# EAGLE design pot-boardDesp2 (EAGLE 6.6.0)
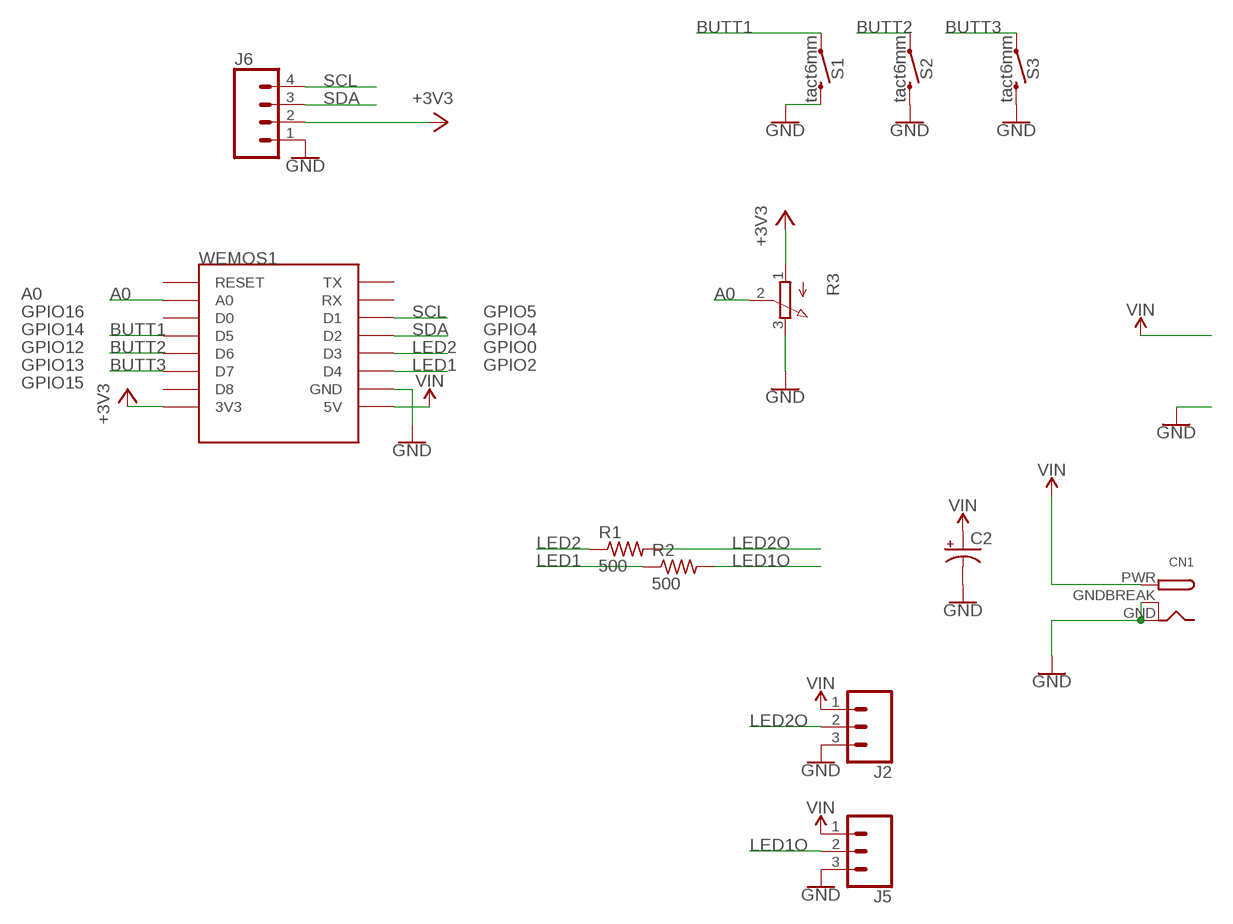
[diagram p0: schematic, sheet 1]

## Parts
C2  CPOL-USE3.5-8  [E3,5-8]
CN1  DCBARRELPTH  [DCJACK_2MM_PTH]
J2  CONN_03  [1X03]
J5  CONN_03  [1X03]
J6  CONN_04  [1X04]
R1  500  R-US_R0805  [R0805]
R2  500  R-US_R0805  [R0805]
R3  3RP/1610N  [3RP/1610N]
S1  tact6mm  MOMENTARY-SWITCH-SPST-PTH-6.0MM  [TACTILE_SWITCH_PTH_6.0MM]
S2  tact6mm  MOMENTARY-SWITCH-SPST-PTH-6.0MM  [TACTILE_SWITCH_PTH_6.0MM]
S3  tact6mm  MOMENTARY-SWITCH-SPST-PTH-6.0MM  [TACTILE_SWITCH_PTH_6.0MM]
WEMOS1  WEMOS-D1-MINI  [WEMOS-D1-MINI]

## Nets
+3V3: J6.2 R3.1(A) WEMOS1.3V3
A0: R3.2(S) WEMOS1.A0
BUTT1: S1.1 WEMOS1.D5
BUTT2: S2.1 WEMOS1.D6
BUTT3: S3.1 WEMOS1.D7
GND: C2.- CN1.GND CN1.GNDBREAK J2.3 J5.3 J6.1 R3.3(E) S1.3 S2.3 S3.3 WEMOS1.GND
LED1: R2.1 WEMOS1.D4
LED1O: J5.2 R2.2
LED2: R1.1 WEMOS1.D3
LED2O: J2.2 R1.2
SCL: J6.4 WEMOS1.D1
SDA: J6.3 WEMOS1.D2
VIN: C2.+ CN1.PWR J2.1 J5.1 WEMOS1.5V
Unconnected: WEMOS1.D0 WEMOS1.D8 WEMOS1.RESET WEMOS1.RX WEMOS1.TX

## Notes on the sheet
- A0
- GPIO16 | GPIO5
- GPIO14 | GPIO4
- GPIO12 | GPIO0
- GPIO13 | GPIO2
- GPIO15

## Library data of the parts
C2 = adafruit:CPOL-US: POLARIZED CAPACITOR, American symbol
CN1 = adafruit:DCBARREL: 2.0mm DC Barrel Jack DCJACK_2MM_PTH - Through Hole Jack (4UConnector: 05537)
J2 J5 = SparkFun-Connectors:CONN_03: Multi connection point. Often used as Generic Header-pin footprint for 0.1 inch spaced/style header connections On any of the 0.1 inch spaced packages, you can populate with these: Break Away Headers - Straight <https://www.sparkfun.com/products/116> (PRT-00116) Break Away Male Headers - Right Angle <https://www.sparkfun.com/products/553> (PRT-00553) Female Headers <https://www.sparkfun.com/products/115> (PRT-00115) Break Away Headers - Machine Pin <https://www.sparkfun.com/products/117> (PRT-00117) Break Away Female Headers - Swiss Machine Pin <https://www.sparkfun.com/products/743> (PRT-00743) Stackable Header - 3 Pin (Female, 0.1") <https://www.sparkfun.com/products/13875> (PRT-13875) For SCREWTERMINALS and SPRING TERMINALS visit here: Screw Terimnals on SparkFun.com <https://www.sparkfun.com/search/results?term=Screw+Terminals> (5mm/3.5mm/2.54mm spacing) This device is also useful as a general connection point to wire up your design to another part of your project. Our various solder wires solder well into these plated through hole pads. Hook-Up Wire - Assortment (Stranded, 22 AWG) <https://www.sparkfun.com/products/11375> (PRT-11375) Hook-Up Wire - Assortment (Solid Core, 22 AWG) <https://www.sparkfun.com/products/11367> (PRT-11367) View the entire wire category on our website here <https://www.sparkfun.com/categories/141> Special notes: Molex polarized connector foot print use with SKU : PRT-08232 with associated crimp pins and housings.
J6 = SparkFun-Connectors:CONN_04: Multi connection point. Often used as Generic Header-pin footprint for 0.1 inch spaced/style header connections On any of the 0.1 inch spaced packages, you can populate with these: Break Away Headers - Straight <https://www.sparkfun.com/products/116> (PRT-00116) Break Away Male Headers - Right Angle <https://www.sparkfun.com/products/553> (PRT-00553) Female Headers <https://www.sparkfun.com/products/115> (PRT-00115) Break Away Headers - Machine Pin <https://www.sparkfun.com/products/117> (PRT-00117) Break Away Female Headers - Swiss Machine Pin <https://www.sparkfun.com/products/743> (PRT-00743) For SCREWTERMINALS and SPRING TERMINALS visit here: Screw Terimnals on SparkFun.com <https://www.sparkfun.com/search/results?term=Screw+Terminals> (5mm/3.5mm/2.54mm spacing) This device is also useful as a general connection point to wire up your design to another part of your project. Our various solder wires solder well into these plated through hole pads. Hook-Up Wire - Assortment (Stranded, 22 AWG) <https://www.sparkfun.com/products/11375> (PRT-11375) Hook-Up Wire - Assortment (Solid Core, 22 AWG) <https://www.sparkfun.com/products/11367> (PRT-11367) View the entire wire category on our website here <https://www.sparkfun.com/categories/141> Special notes: Molex polarized connector foot print use with SKU : PRT-08231 with associated crimp pins and housings. 1MM SMD Version SKU: PRT-10208; PROD_ID: CONN-09696
R1 R2 = adafruit:R-US_: RESISTOR, American symbol
R3 = pot:3RP/1610N: 16mm Potentiometer one level Source: http://www.alphapotentiometers.net/html/16mm_pot_2.html
S1-S3 = SparkFun-Switches:MOMENTARY-SWITCH-SPST: Momentary Switch (Pushbutton) - SPST Normally-open (NO) SPST momentary switches (buttons, pushbuttons). Variants PTH-12MM - 12mm square, through-hole Momentary Pushbutton Switch - 12mm Square <https://www.sparkfun.com/products/9190> (COM-09190) PTH-6.0MM, PTH-6.0MM-KIT - 6.0mm square, through-hole Mini Pushbutton Switch <https://www.sparkfun.com/products/97> (COM-00097) KIT package intended for soldering kit's - only one side of pads' copper is exposed. PTH-RIGHT-ANGLE-KIT - Right-angle, through-hole Right Angle Tactile Button <https://www.sparkfun.com/products/10791> - Used on SparkFun BigTime Watch Kit <https://www.sparkfun.com/products/11734> SMD-12MM - 12mm square, surface-mount Tactile Button - SMD (12mm) <https://www.sparkfun.com/products/12993> (COM-12993) Used on SparkFun PicoBoard <https://www.sparkfun.com/products/11888> SMD-4.5MM - 4.5mm Square Trackball Switch Used on SparkFun Blackberry Trackballer Breakout <https://www.sparkfun.com/products/13169> SMD-4.6MMX2.8MM - 4.60mm x 2.80mm, surface mount Used on SparkFun SAMD21 Mini Breakout <https://www.sparkfun.com/products/13664> SMD-5.2MM, SMD-5.2-REDUNDANT - 5.2mm square, surface-mount Mini Pushbutton Switch - SMD <https://www.sparkfun.com/products/8720> (COM-08720) Used on Arduino Pro Mini <https://www.sparkfun.com/products/11114> REDUNDANT package connects both switch circuits together SMD-6.0X3.5MM - 6.0 x 3.5mm, surface mount Momentary Reset Switch SMD <https://www.sparkfun.com/products/8229> (COM-08229) SMD-6.2MM-TALL - 6.2mm square, surface mount Tactile Button - SMD (6mm) <https://www.sparkfun.com/products/12992> Used on SparkFun Digital Sandbox <https://www.sparkfun.com/products/12651> SMD-RIGHT-ANGLE - Right-angle, surface mount Used on SparkFun Block for Intel® Edison - Arduino <https://www.sparkfun.com/products/13036>; PROD_ID: SWCH-08441; SF_SKU: COM-00097
WEMOS1 = esp8266modules:WEMOS-D1-MINI: WeMos.cc D1 mini ESP8266 module

## Board
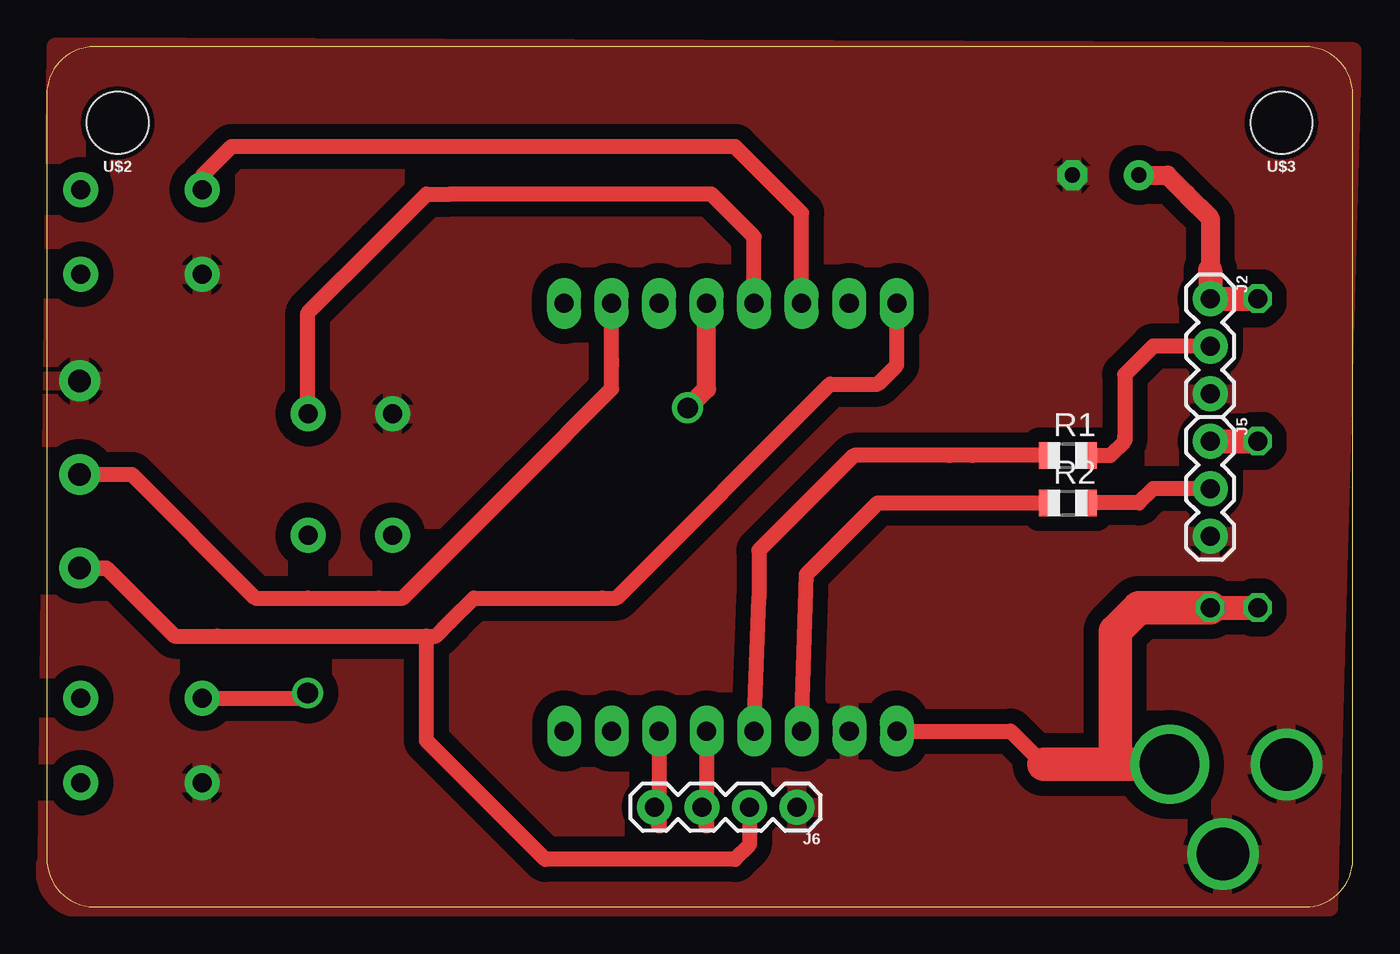
[diagram p1: board, top side]
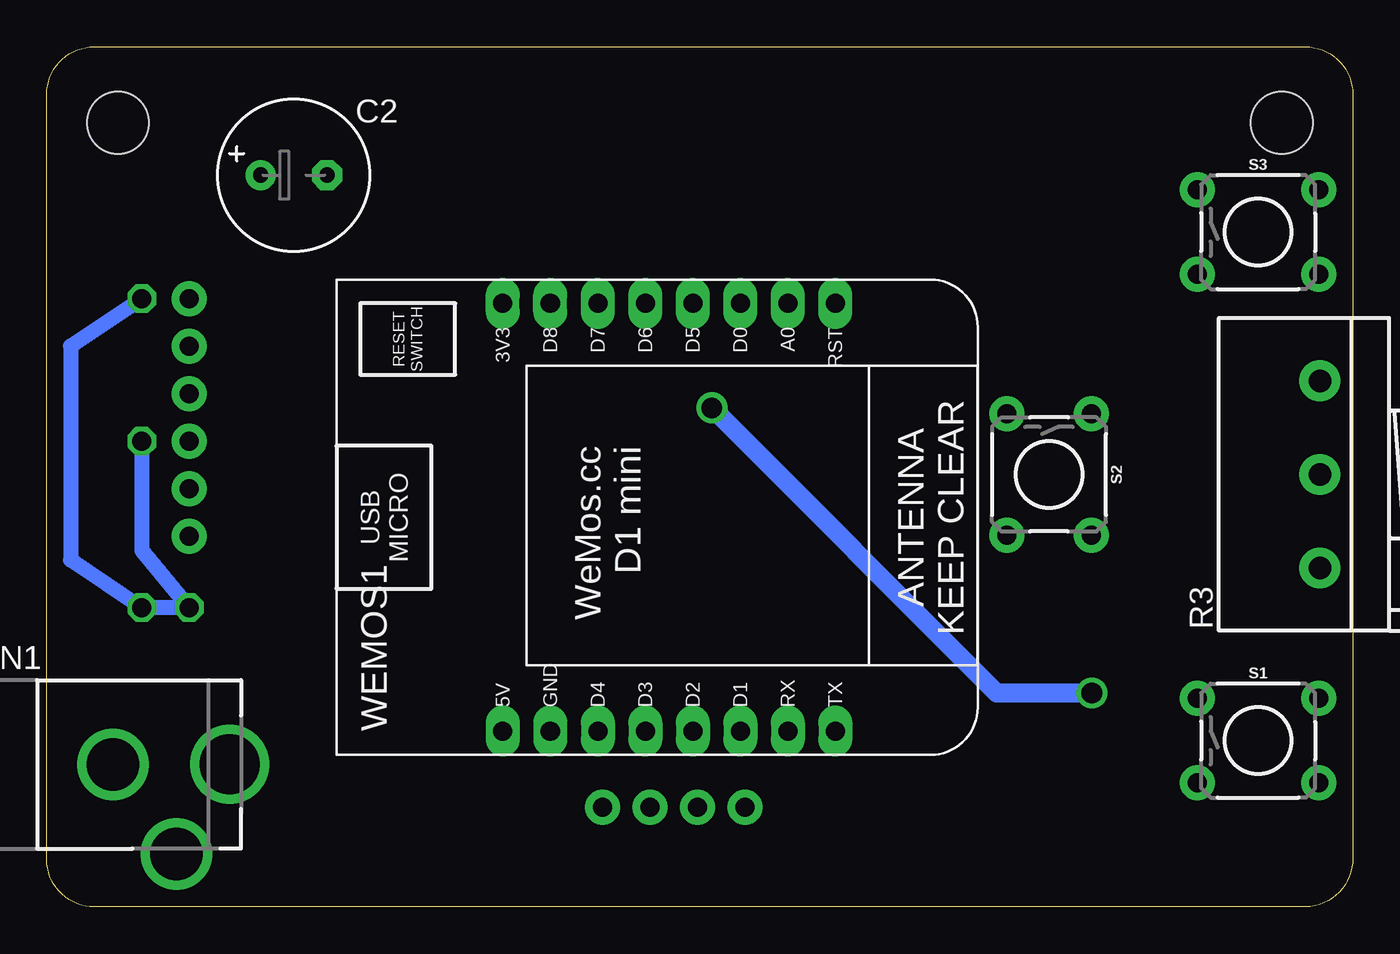
[diagram p2: board, bottom side, seen from below]

Size 69.83 x 45.97 mm. Coordinates in mm from the lower left corner, seen from the top.
Outline: 69.83,2.54 69.83,43.43 arc90 67.29,45.97 2.54,45.97 arc90 0,43.43 0,2.61 arc90 2.52,0 67.29,0 arc90 69.83,2.54
Copper layers (1*16): Top 0.035mm / dielectric 1.5mm / Bottom 0.035mm
Design rules "OthermillDRC_1_32_v2": minimum track width 8mil, minimum drill 0.8mm, track to track 0.794003125mm, track to pad 0.794003125mm, pad to pad 0.794003125mm, via to via 0.794003125mm, smd to smd 0mil, copper to edge 0mil, drill to drill 1mil, minimum pad ring 10mil, minimum via ring 10mil, stop-mask expansion 1mil, vias tented up to drill 30mil, thermal gap 10mil

### Footprints (pad centres in the part's own frame; a part is rotated, then mirrored left to right if it is on the bottom)
E3,5-8 = drill 0.813 pad 1.6: + -1.778,0 | drill 0.813 pad 1.6 octagon: - 1.778,0
DCJACK_2MM_PTH = drill 2.8: GND 0,7.35; GNDBREAK 4.8,10.75 | drill 3.2: PWR 0,13.6
1X03 = drill 1.016 pad 1.88: 1 0,0; 2 2.54,0; 3 5.08,0
1X04 = drill 1.016 pad 1.88: 1 0,0; 2 2.54,0; 3 5.08,0; 4 7.62,0
R0805 = smd 1.1 x 1.4: 1 -1,0; 2 1,0
3RP/1610N = drill 1.2 pad 2.184: 1 -5,0; 2 0,0; 3 5,0
TACTILE_SWITCH_PTH_6.0MM = drill 1.016 pad 1.88: 1 -3.251,2.261; 2 3.251,2.261; 3 -3.251,-2.261; 4 3.251,-2.261
STAND-OFF = hole 3.302: 0,0
WEMOS-D1-MINI = drill 1.016 pad 1.829 long: 3V3 -10.16,-10.16; 5V 12.7,-10.16; A0 -10.16,5.08; D0 -10.16,2.54; D1 12.7,2.54; D2 12.7,0; D3 12.7,-2.54; D4 12.7,-5.08; D5 -10.16,0; D6 -10.16,-2.54; D7 -10.16,-5.08; D8 -10.16,-7.62; GND 12.7,-7.62; RESET -10.16,7.62; RX 12.7,5.08; TX 12.7,7.62

### Placement (x,y rotation side)
C2  56.62,39.12 0 bottom
CN1  73.64,7.62 270 bottom
J2  62.21,32.51 270 top
J5  62.21,24.89 270 top
J6  40.11,5.33 180 top
R1  54.59,24.13 0 top
R2  54.59,21.59 0 top
R3  1.76,23.11 90 bottom
S1  5.06,8.89 0 bottom
S2  16.24,23.11 270 bottom
S3  5.06,36.07 0 bottom
U$2  [STAND-OFF]  3.79,41.91 180 top
U$3  [STAND-OFF]  66.02,41.91 180 top
WEMOS1  35.29,22.1 270 bottom

### Tracks (layer width: path | path; a pad name or v marks a point on that pad's centre or on a via)
+3V3
  Top 0.813: R3.1 2.52,18.11 | 2.52,18.11 3.2,18.11 | 3.2,18.11 2.52,18.11 | J6.2 37.57,3.3 36.81,2.54 26.65,2.54 20.3,8.89 20.3,14.48 | WEMOS1.3V3 45.45,28.96 44.43,27.94 41.89,27.94 30.46,16.51 29.7,16.51 22.84,16.51 21.57,15.24 20.81,14.48 20.3,14.48 | 20.3,14.48 9.12,14.48 6.84,14.48 3.2,18.11
A0
  Top 0.813: 30.21,28.96 30.21,29.21 | 30.21,29.21 WEMOS1.A0 | R3.2 4.55,23.11 11.16,16.51 13.95,16.51 17.76,16.51 19.03,16.51 25.38,22.86 30.21,27.69 30.21,29.21
BUTT1  (via drill 1.1)
  Top 0.813: S1.1 13.95,11.15 v13.95,11.43
  Top 1.016: v34.27,26.67 35.29,27.69 WEMOS1.D5
  Bottom 1.016: v13.95,11.43 19.03,11.43 v34.27,26.67
BUTT2
  Top 0.813: WEMOS1.D6 37.83,35.81 35.54,38.1 21.57,38.1 20.3,38.1 17.76,35.56 13.95,31.75 13.95,26.42 13.95,26.39 S2.1
BUTT3
  Top 0.813: WEMOS1.D7 40.37,37.08 36.81,40.64 9.86,40.64 8.31,39.09 S3.1
GND
  pour Top: 0.49,45.97 0.01,2.57 arc91 1.28,0 68.56,0 69.83,45.72
LED1
  Top 0.813: WEMOS1.D4 40.62,17.78 44.43,21.59 R2.1
LED1O
  Top 0.813: J5.2 59.16,22.35 58.4,21.59 R2.2
LED2
  Top 0.813: R1.1 49.51,24.13 48.24,24.13 43.16,24.13 38.08,19.05 38.08,16.51 WEMOS1.D3
LED2O
  Top 0.813: R1.2 56.88,24.13 57.64,24.89 57.64,25.15 57.64,28.45 59.16,29.97 J2.2
SCL
  Top 0.813: WEMOS1.D1 32.75,4.32 J6.4
SDA
  Top 0.813: WEMOS1.D2 35.29,4.32 J6.3
VIN  (via drill 1.02)
  Top 0.813: WEMOS1.5V 51.54,9.4 53.32,7.62
  Top 1.016: C2.+ 59.92,39.12 60.94,38.1 62.21,36.83 62.21,34.04
  Top 1.27: v64.75,32.51 J2.1 62.21,34.04 | J5.1 v64.75,24.89 | v62.21,16 v64.75,16
  Top 1.778: 57.13,7.62 57.13,14.73 58.4,16 v62.21,16 | CN1.PWR 57.13,7.62 | 53.32,7.62 57.13,7.62
  Bottom 0.813: v64.75,32.51 68.56,29.97 68.56,18.54 v64.75,16 v62.21,16 64.75,19.05 v64.75,24.89

### Text on the board
tPlace: ILOVELAMP | pot-boardDesp2